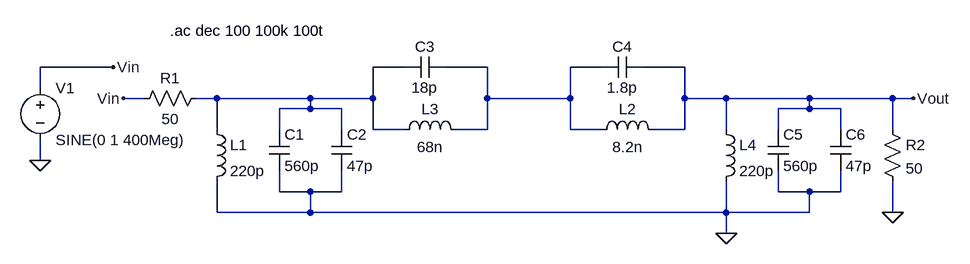
[diagram p0: schematic Cauer_bandpass_standard.asc]
Cauer_bandpass_standard.asc, the LTspice schematic file:
Version 4
SHEET 1 1376 680
WIRE 64 208 -48 208
WIRE 512 208 464 208
WIRE 640 208 576 208
WIRE 816 208 768 208
WIRE 944 208 880 208
WIRE -48 240 -48 208
WIRE 112 256 80 256
WIRE 224 256 192 256
WIRE 368 256 224 256
WIRE 464 256 464 208
WIRE 464 256 368 256
WIRE 640 256 640 208
WIRE 768 256 768 208
WIRE 768 256 640 256
WIRE 944 256 944 208
WIRE 1008 256 944 256
WIRE 1136 256 1008 256
WIRE 1264 256 1136 256
WIRE 1296 256 1264 256
WIRE 368 272 368 256
WIRE 368 272 320 272
WIRE 416 272 368 272
WIRE 1136 272 1136 256
WIRE 1136 272 1088 272
WIRE 1184 272 1136 272
WIRE 224 304 224 256
WIRE 320 304 320 272
WIRE 416 304 416 272
WIRE 464 304 464 256
WIRE 512 304 464 304
WIRE 640 304 640 256
WIRE 640 304 592 304
WIRE 768 304 768 256
WIRE 816 304 768 304
WIRE 944 304 944 256
WIRE 944 304 896 304
WIRE 1008 304 1008 256
WIRE 1088 304 1088 272
WIRE 1184 304 1184 272
WIRE 1264 304 1264 256
WIRE -48 352 -48 320
WIRE 320 400 320 368
WIRE 368 400 320 400
WIRE 416 400 416 368
WIRE 416 400 368 400
WIRE 1088 400 1088 368
WIRE 1136 400 1088 400
WIRE 1184 400 1184 368
WIRE 1184 400 1136 400
WIRE 224 432 224 384
WIRE 368 432 368 400
WIRE 368 432 224 432
WIRE 1008 432 1008 384
WIRE 1008 432 368 432
WIRE 1136 432 1136 400
WIRE 1136 432 1008 432
WIRE 1264 432 1264 384
WIRE 1008 464 1008 432
FLAG -48 352 0
FLAG 64 208 Vin
FLAG 80 256 Vin
FLAG 1264 432 0
FLAG 1296 256 Vout
FLAG 1008 464 0
SYMBOL voltage -48 224 R0
SYMATTR InstName V1
SYMATTR Value SINE(0 1 400Meg)
SYMATTR Value2 AC 1
SYMBOL res 208 240 R90
WINDOW 0 0 56 VBottom 2
WINDOW 3 32 56 VTop 2
SYMATTR InstName R1
SYMATTR Value 50
SYMBOL ind 208 288 R0
SYMATTR InstName L1
SYMATTR Value 220p
SYMBOL ind 800 320 R270
WINDOW 0 32 56 VTop 2
WINDOW 3 5 56 VBottom 2
SYMATTR InstName L2
SYMATTR Value 8.2n
SYMBOL cap 816 224 R270
WINDOW 0 32 32 VTop 2
WINDOW 3 0 32 VBottom 2
SYMATTR InstName C4
SYMATTR Value 1.8p
SYMBOL ind 496 320 R270
WINDOW 0 32 56 VTop 2
WINDOW 3 5 56 VBottom 2
SYMATTR InstName L3
SYMATTR Value 68n
SYMBOL cap 512 224 R270
WINDOW 0 32 32 VTop 2
WINDOW 3 0 32 VBottom 2
SYMATTR InstName C3
SYMATTR Value 18p
SYMBOL res 1248 288 R0
SYMATTR InstName R2
SYMATTR Value 50
SYMBOL ind 992 288 R0
SYMATTR InstName L4
SYMATTR Value 220p
SYMBOL cap 304 304 R0
SYMATTR InstName C1
SYMATTR Value 560p
SYMBOL cap 400 304 R0
SYMATTR InstName C2
SYMATTR Value 47p
SYMBOL cap 1072 304 R0
SYMATTR InstName C5
SYMATTR Value 560p
SYMBOL cap 1168 304 R0
SYMATTR InstName C6
SYMATTR Value 47p
TEXT 152 152 Left 2 !.ac dec 100 100k 100t

The netlist it stands for:
* Cauer_bandpass_standard.asc
V1 Vin 0 SINE(0 1 400Meg) AC 1
R1 N001 Vin 50
L1 N001 0 220p
L2 N002 Vout 8.2n
C4 N002 Vout 1.8p
L3 N001 N002 68n
C3 N001 N002 18p
R2 Vout 0 50
L4 Vout 0 220p
C1 N001 0 560p
C2 N001 0 47p
C5 Vout 0 560p
C6 Vout 0 47p
.ac dec 100 100k 100t
.backanno
.end